# Altium schematic sheet rp3a0-mini-main.SchDoc
size A4; SheetNumber: 1; SheetTotal: 6
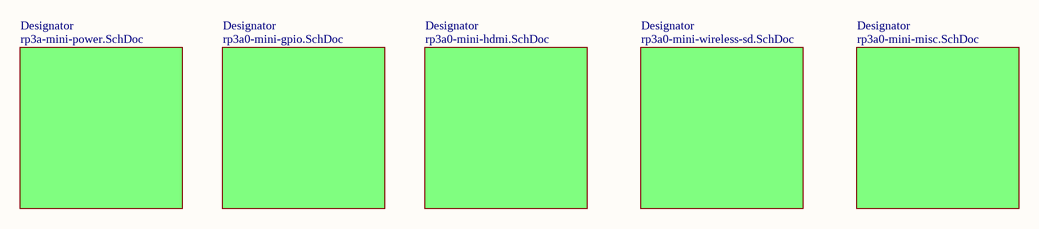
[diagram p0: rp3a0-mini-main.SchDoc]

## Sub-sheets
Designator = rp3a-mini-power.SchDoc: no entries
Designator = rp3a0-mini-gpio.SchDoc: no entries
Designator = rp3a0-mini-hdmi.SchDoc: no entries
Designator = rp3a0-mini-wireless-sd.SchDoc: no entries
Designator = rp3a0-mini-misc.SchDoc: no entries